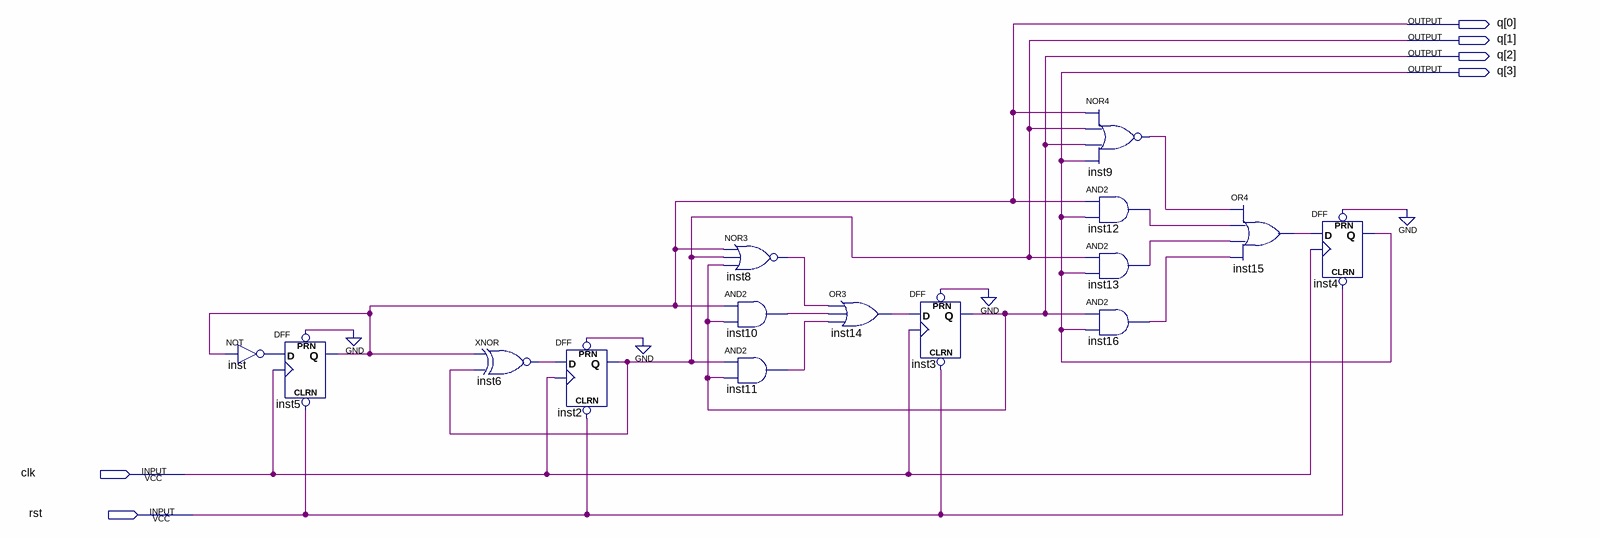
[diagram p0: schematic sheet]
// Quartus schematic backup.bdf as structural Verilog: 15 symbols, 6 pins
module backup (
  input  clk,
  input  rst,
  output [3:0] q
);

  wire inst6_out, inst8_out, inst9_out, inst10_out, inst11_out, inst12_out, inst13_out, inst14_out,
       inst15_out, inst16_out, inst_out;

  not inst (inst_out, q[0]);
  DFF inst5 (.CLRN(rst), .CLK(clk), .D(inst_out), .PRN(1'b0), .Q(q[0]));
  xnor inst6 (inst6_out, q[0], q[1]);
  DFF inst2 (.CLRN(rst), .CLK(clk), .D(inst6_out), .PRN(1'b0), .Q(q[1]));
  nor inst8 (inst8_out, q[0], q[1], q[2]);
  and inst10 (inst10_out, q[0], q[2]);
  and inst11 (inst11_out, q[1], q[2]);
  or inst14 (inst14_out, inst8_out, inst10_out, inst11_out);
  DFF inst3 (.CLRN(rst), .CLK(clk), .D(inst14_out), .PRN(1'b0), .Q(q[2]));
  nor inst9 (inst9_out, q[0], q[1], q[2], q[3]);
  and inst12 (inst12_out, q[0], q[3]);
  and inst13 (inst13_out, q[1], q[3]);
  and inst16 (inst16_out, q[2], q[3]);
  or inst15 (inst15_out, inst9_out, inst12_out, inst13_out, inst16_out);
  DFF inst4 (.CLRN(rst), .CLK(clk), .D(inst15_out), .PRN(1'b0), .Q(q[3]));
endmodule
